# Altium schematic sheet 1_BLE.SchDoc
size A4; SheetNumber: 2; SheetTotal: 4
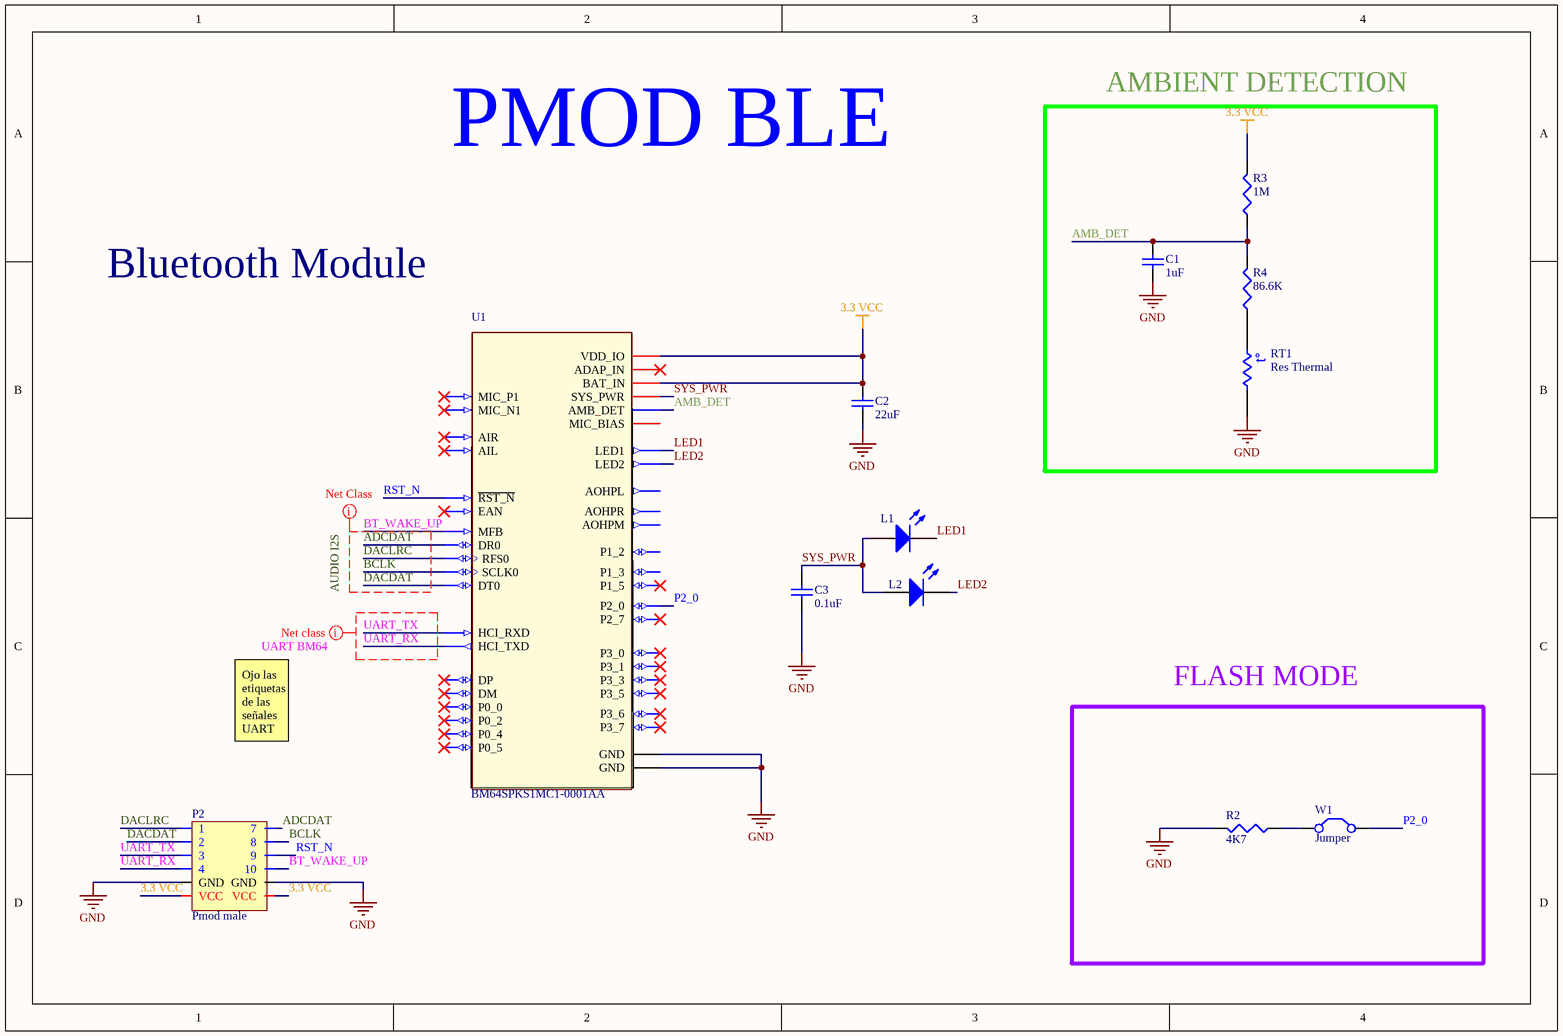
[diagram p0: 1_BLE.SchDoc]

## Parts
C1  1uF  [Cap0805]
C2  value 22uF  [C1210]  (hidden comment: Cap Semi)
C3  0.1uF  [Cap0805]
L1  LED1  [Diode1206]  (value not drawn)
L2  LED1  [Diode1206]  (value not drawn)
P2  Pmod male  [901220766]
R2  value 4K7  [Resistor 0805]  (hidden comment: Res3)
R3  value 1M  [Resistor 0805]  (hidden comment: Res3)
R4  value 86.6K  [Resistor 0805]  (hidden comment: Res3)
RT1  Res Thermal  [6-0805_N]
U1  BM64SPKS1MC1-0001AA  [*MODULE_BM64SPKS1MC1-0001AA]
W1  Jumper  [Shunt jumper]

## Blocks framed on the sheet
AMBIENT DETECTION: C1 R3 R4 RT1
FLASH MODE: R2 W1

## Nets
3.3 VCC: C2.2 P2.6(VCC) P2.12(VCC) R3.2 U1.21(VDD_IO) U1.22(BAT_IN)
GND: C1.1 C2.1 C3.2 P2.5(GND) P2.11(GND) R2.2 RT1.2 U1.14(GND) U1.43(GND)
ADCDAT: P2.7 U1.1(DR0)
AMB_DET: C1.2 R3.1 R4.2 U1.25(AMB_DET)
BCLK: P2.8 U1.3(SCLK0)
BT_WAKE_UP: P2.10 U1.26(MFB)
DACDAT: P2.2 U1.4(DT0)
DACLRC: P2.1 U1.2(RFS0)
LED1: L1.2(K) U1.28(LED1)
LED2: L2.2(K) U1.27(LED2)
P2_0: U1.41(P2_0) W1.2(C2)
RST_N: P2.9 U1.13(~{RST_N})
SYS_PWR: C3.1 L1.1(A) L2.1(A) U1.24(SYS_PWR)
UART_RX: P2.4 U1.20(HCI_TXD)
UART_TX: P2.3 U1.19(HCI_RXD)
NetR2_1: R2.1 W1.1(C1)
NetR4_1: R4.1 RT1.1

Not connected (* = marked no-connect by the designer): U1 5(AOHPR) 6(AOHPM) 7(AOHPL) 8(MIC_N1)* 9(MIC_P1)* 10(MIC_BIAS) 11(AIR)* 12(AIL)* 15(P1_2) 16(P1_3) 17(P0_4)* 18(P1_5)* 23(ADAP_IN)* 29(P3_7)* 30(P3_5)* 31(P0_0)* 32(EAN)* 33(DM)* 34(DP)* 35(P0_5)* 36(P3_0)* 37(P3_1)* 38(P3_3)* 39(P3_6)* 40(P0_2)* 42(P2_7)*

## Layout directives
net class AUDIO I2S: ADCDAT, BCLK, BT_WAKE_UP, DACDAT, DACLRC
net class UART BM64: UART_RX, UART_TX

## Notes on the sheet
- PMOD BLE
- Bluetooth Module
- Ojo las etiquetas de las señales UART son de las del dispositivo que se conecte
- (in symbol Res Thermal) t°

## Library data of the parts
C1 C3 = Cap: capacitor; ASiD Part Number: C-AS; Volte: 25v; ClassName: OutBuck
  C1: Value: 1uF
  C3: Value: 0.1uF
C2 = Cap Semi: Capacitor (Semiconductor SIM Model); Published: 8-Jun-2000; LatestRevisionDate: 29-May-2009; LatestRevisionNote: IPC-7351 Footprint Added.; PackageReference: C1206; Publisher: Altium Limited; PackageDescription: Chip Capacitor
L1 L2 = LED1: Typical RED GaAs LED; Published: 8-Jun-2000; LatestRevisionDate: 08-Jul-2005; LatestRevisionNote: Mech Layer 1 removed.; PackageReference: LED-1; Publisher: Altium Limited; PackageDescription: LED; 2 Leads; Digi-KeyReference: 732-13395-1-ND
P2 = Pmod male: p mod male 6 position 2 rows
R2-R4 = Res3: Resistor; Published: 8-Jun-2000; LatestRevisionDate: 29-May-2009; LatestRevisionNote: IPC-7351 Footprint Added.; PackageReference: J1-0603; Publisher: Altium Limited; PackageDescription: Chip Resistor
RT1 = Res Thermal: Thermistor; R at 25: 100k; Published: 24-Mar-1999; LatestRevisionDate: 29-May-2009; LatestRevisionNote: IPC-7351 Footprint Added.; PackageVersion: Mar-2003; PackageReference: 6-0805; Publisher: Altium Limited; PackageDescription: Chip Resistor 0805 Case Size; Code_IPC: RESC2012; Digi-KeyReference: BC2562CT-ND
U1 = BM64SPKS1MC1-0001AA: Bluetooth Bluetooth v5.0 Transceiver Module 2.4GHz Integrated, Trace Surface Mount; MF: Microchip; Availability: Unavailable; Package: Module Microchip; Price: None; MP: BM64SPKS1MC1-0001AA; SnapEDA_Link: https://www.snapeda.com/parts/BM64SPKS1MC1-0001AA/Microchip/view-part/613145/?ref=snap; Value: *
W1 = Jumper: Jumper Wire; Published: 24-Mar-1999; LatestRevisionDate: 17-Jul-2002; LatestRevisionNote: Re-released for DXP Platform.; PackageReference: RAD-0.2; Publisher: Altium Limited; PackageDescription: Radial Cap, Thru-Hole; 2 Leads; 0.2 in Pin Spacing; Digi-KeyReferencer: S9000-ND